# Altium schematic sheet Door Position Monitoring.SchDoc: LCL_GDI (DELUX)
size A4; Address1: ludzinc.blogspot.com.au; Address3: www.lowcostlabs.com.au; DocumentNumber: LCL_004; Revision: V2.00; SheetNumber: 7; SheetTotal: 8
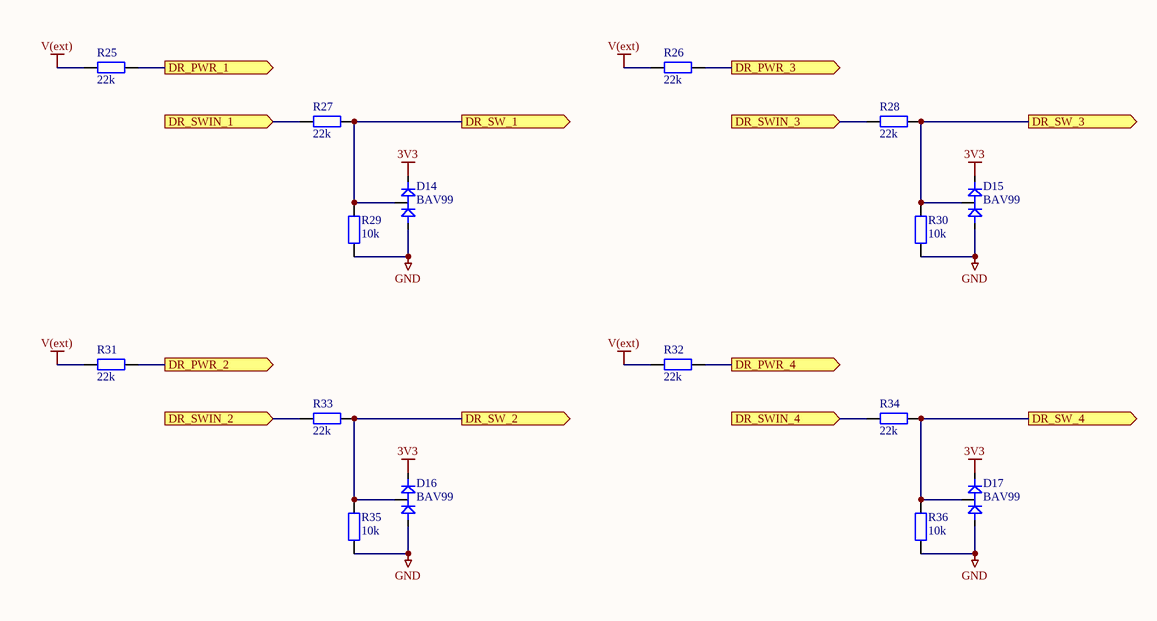
[diagram p0: Door Position Monitoring.SchDoc]

## Parts
D14  BAV99  [ONSC-SOT-23-3-318-08_V]
D15  BAV99  [ONSC-SOT-23-3-318-08_V]
D16  BAV99  [ONSC-SOT-23-3-318-08_V]
D17  BAV99  [ONSC-SOT-23-3-318-08_V]
R25  22k  [PCB-3652081-2]
R26  22k  [PCB-3652081-2]
R27  22k  [PCB-3652081-2]
R28  22k  [PCB-3652081-2]
R29  10k  [PCB-3652081-2]
R30  10k  [PCB-3652081-2]
R31  22k  [PCB-3652081-2]
R32  22k  [PCB-3652081-2]
R33  22k  [PCB-3652081-2]
R34  22k  [PCB-3652081-2]
R35  10k  [PCB-3652081-2]
R36  10k  [PCB-3652081-2]

## Ports
DR_PWR_1 (out), DR_PWR_2 (out), DR_PWR_3 (out), DR_PWR_4 (out), DR_SW_1 (out), DR_SW_2 (out), DR_SW_3 (out), DR_SW_4 (out), DR_SWIN_1 (in), DR_SWIN_2 (in), DR_SWIN_3 (in), DR_SWIN_4 (in)

## Nets
3V3: D14.2(K) D15.2(K) D16.2(K) D17.2(K)
GND: D14.1(A) D15.1(A) D16.1(A) D17.1(A) R29.1 R30.1 R35.1 R36.1
V(ext): R25.2 R26.2 R31.2 R32.2
DR_PWR_1: R25.1 ; port DR_PWR_1
DR_PWR_2: R31.1 ; port DR_PWR_2
DR_PWR_3: R26.1 ; port DR_PWR_3
DR_PWR_4: R32.1 ; port DR_PWR_4
DR_SW_1: D14.3(K/A) R27.1 R29.2 ; port DR_SW_1
DR_SW_2: D16.3(K/A) R33.1 R35.2 ; port DR_SW_2
DR_SW_3: D15.3(K/A) R28.1 R30.2 ; port DR_SW_3
DR_SW_4: D17.3(K/A) R34.1 R36.2 ; port DR_SW_4
DR_SWIN_1: R27.2 ; port DR_SWIN_1
DR_SWIN_2: R33.2 ; port DR_SWIN_2
DR_SWIN_3: R28.2 ; port DR_SWIN_3
DR_SWIN_4: R34.2 ; port DR_SWIN_4

## Notes on the sheet
- LOW COST LABS
- Title
- Size:
- Date:
- A4
- Number:
- Revision:
- Sheet
- of
- File:

## Library data of the parts
D14-D17 = CMP-10548246-4: Dual Series Switching Diodes, 3-Pin SOT-23, Pb-Free, Tape and Reel; Voltage Rating (DC): 70.0 V; Current Rating: 0.2 A; Lead-Free Status: Lead Free; Forward Voltage: 1.0 V; Capacitance: 1.5e-12 F; Case/Package: SOT-23; REACH SVHC Compliance: No SVHC; RoHS: Compliant; Octopart Url: https://octopart.com/bav99lt1g-on+semiconductor-55396102; Number of Pins: 3; Halogen Free Status: Halogen Free; Lifecycle Status: Active; Mounting Style: Surface Mount; OctopartID: b3e779a0d1876c20
R25-R36 = CMP-rprrpiwz7au7w5x5ojb2-2: GENERIC 0805 RESISTOR; CustomComponentID: rprrpiwz7au7w5x5ojb2